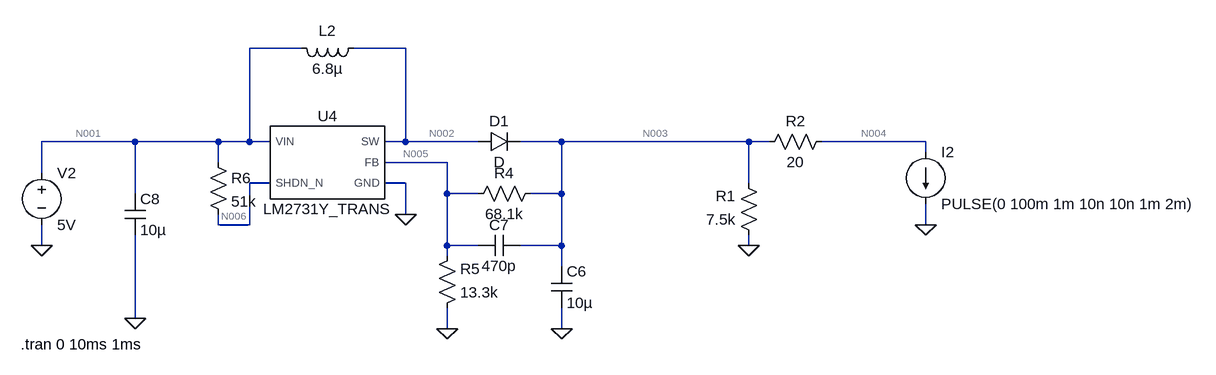
[diagram p0: schematic power_supply_5.asc]
power_supply_5.asc, the LTspice schematic file:
Version 4
SHEET 1 1744 680
WIRE 176 -608 96 -608
WIRE 336 -608 256 -608
WIRE -80 -464 -224 -464
WIRE 48 -464 -80 -464
WIRE 96 -464 96 -608
WIRE 96 -464 48 -464
WIRE 128 -464 96 -464
WIRE 336 -464 336 -608
WIRE 336 -464 304 -464
WIRE 448 -464 336 -464
WIRE 576 -464 512 -464
WIRE 864 -464 576 -464
WIRE 896 -464 864 -464
WIRE 1136 -464 976 -464
WIRE 1136 -448 1136 -464
WIRE 48 -432 48 -464
WIRE 400 -432 304 -432
WIRE -224 -416 -224 -464
WIRE 128 -400 96 -400
WIRE 336 -400 304 -400
WIRE 864 -400 864 -464
WIRE -80 -384 -80 -464
WIRE 400 -384 400 -432
WIRE 448 -384 400 -384
WIRE 576 -384 576 -464
WIRE 576 -384 528 -384
WIRE 336 -352 336 -400
WIRE 48 -336 48 -352
WIRE 96 -336 96 -400
WIRE 96 -336 48 -336
WIRE 1136 -336 1136 -368
WIRE -224 -304 -224 -336
WIRE 400 -304 400 -384
WIRE 448 -304 400 -304
WIRE 576 -304 576 -384
WIRE 576 -304 512 -304
WIRE 864 -304 864 -320
WIRE 400 -288 400 -304
WIRE 576 -272 576 -304
WIRE -80 -192 -80 -320
WIRE 400 -176 400 -208
WIRE 576 -176 576 -208
FLAG 400 -176 0
FLAG 576 -176 0
FLAG -80 -192 0
FLAG 336 -352 0
FLAG -224 -304 0
FLAG 1136 -336 0
FLAG 864 -304 0
SYMBOL ind 272 -624 R90
WINDOW 0 5 56 VBottom 2
WINDOW 3 32 56 VTop 2
SYMATTR InstName L2
SYMATTR Value 6.8µ
SYMBOL cap 560 -272 R0
SYMATTR InstName C6
SYMATTR Value 10µ
SYMBOL res 544 -400 R90
WINDOW 0 0 56 VBottom 2
WINDOW 3 32 56 VTop 2
SYMATTR InstName R4
SYMATTR Value 68.1k
SYMBOL res 384 -192 M180
WINDOW 0 36 76 Left 2
WINDOW 3 36 40 Left 2
SYMATTR InstName R5
SYMATTR Value 13.3k
SYMBOL cap 512 -320 R90
WINDOW 0 0 32 VBottom 2
WINDOW 3 32 32 VTop 2
SYMATTR InstName C7
SYMATTR Value 470p
SYMBOL cap -96 -384 R0
SYMATTR InstName C8
SYMATTR Value 10µ
SYMBOL voltage -224 -432 R0
WINDOW 123 0 0 Left 0
WINDOW 39 0 0 Left 0
SYMATTR InstName V2
SYMATTR Value 5V
SYMBOL res 32 -448 R0
SYMATTR InstName R6
SYMATTR Value 51k
SYMBOL current 1136 -448 R0
WINDOW 123 0 0 Left 0
WINDOW 39 0 0 Left 0
SYMATTR InstName I2
SYMATTR Value PULSE(0 100m 1m 10n 10n 1m 2m)
SYMBOL LM2731Y_TRANS 208 -432 R0
SYMATTR InstName U4
SYMBOL res 880 -304 R180
WINDOW 0 36 76 Left 2
WINDOW 3 36 40 Left 2
SYMATTR InstName R1
SYMATTR Value 7.5k
SYMBOL res 880 -448 R270
WINDOW 0 32 56 VTop 2
WINDOW 3 0 56 VBottom 2
SYMATTR InstName R2
SYMATTR Value 20
SYMBOL diode 448 -448 R270
WINDOW 0 32 32 VTop 2
WINDOW 3 0 32 VBottom 2
SYMATTR InstName D1
TEXT -256 -152 Left 2 !.tran 0 10ms 1ms

The netlist it stands for:
* power_supply_5.asc
L2 N002 N001 6.8µ
C6 N003 0 10µ
R4 N003 N005 68.1k
R5 0 N005 13.3k
C7 N003 N005 470p
C8 N001 0 10µ
V2 N001 0 5V
R6 N001 N006 51k
I2 N004 0 PULSE(0 100m 1m 10n 10n 1m 2m)
XU4 N001 N006 N002 N005 0 LM2731Y_TRANS  ; pins VIN SHDN_N SW FB GND
R1 0 N003 7.5k
R2 N003 N004 20
D1 N002 N003 D
.model D D
.lib standard.dio
.tran 0 10ms 1ms
.lib D:\Users\javi_\GitHub\Microwatt_Board\Simu_Microwatt_Board\LM2731Y_TRANS.LIB
.backanno
.end

* Results of the author's LTspice run, read from the files saved beside the schematic
* Operating Point, zero values left out:
*   V(n002) = 5 V
*   V(n001) = 5 V
*   V(n003) = 4.357 V
*   V(n005) = 711.8 mV
*   V(n006) = 4.997 V
*   V(n004) = 4.357 V
*   I(D1) = 634.4 µA
*   I(L2) = -634.4 µA
*   I(R1) = -580.9 µA
*   I(R6) = 49.97 nA
*   I(R5) = -53.52 µA
*   I(R4) = 53.52 µA
*   I(V2) = -634.5 µA
*   Ix(u4:SHDN_N) = 49.97 nA
*   Ix(u4:SW) = 5.009 nA
*   Ix(u4:GND) = -54.98 nA